# EAGLE design SUSTAINA-Core-Board (EAGLE 9.6.2)
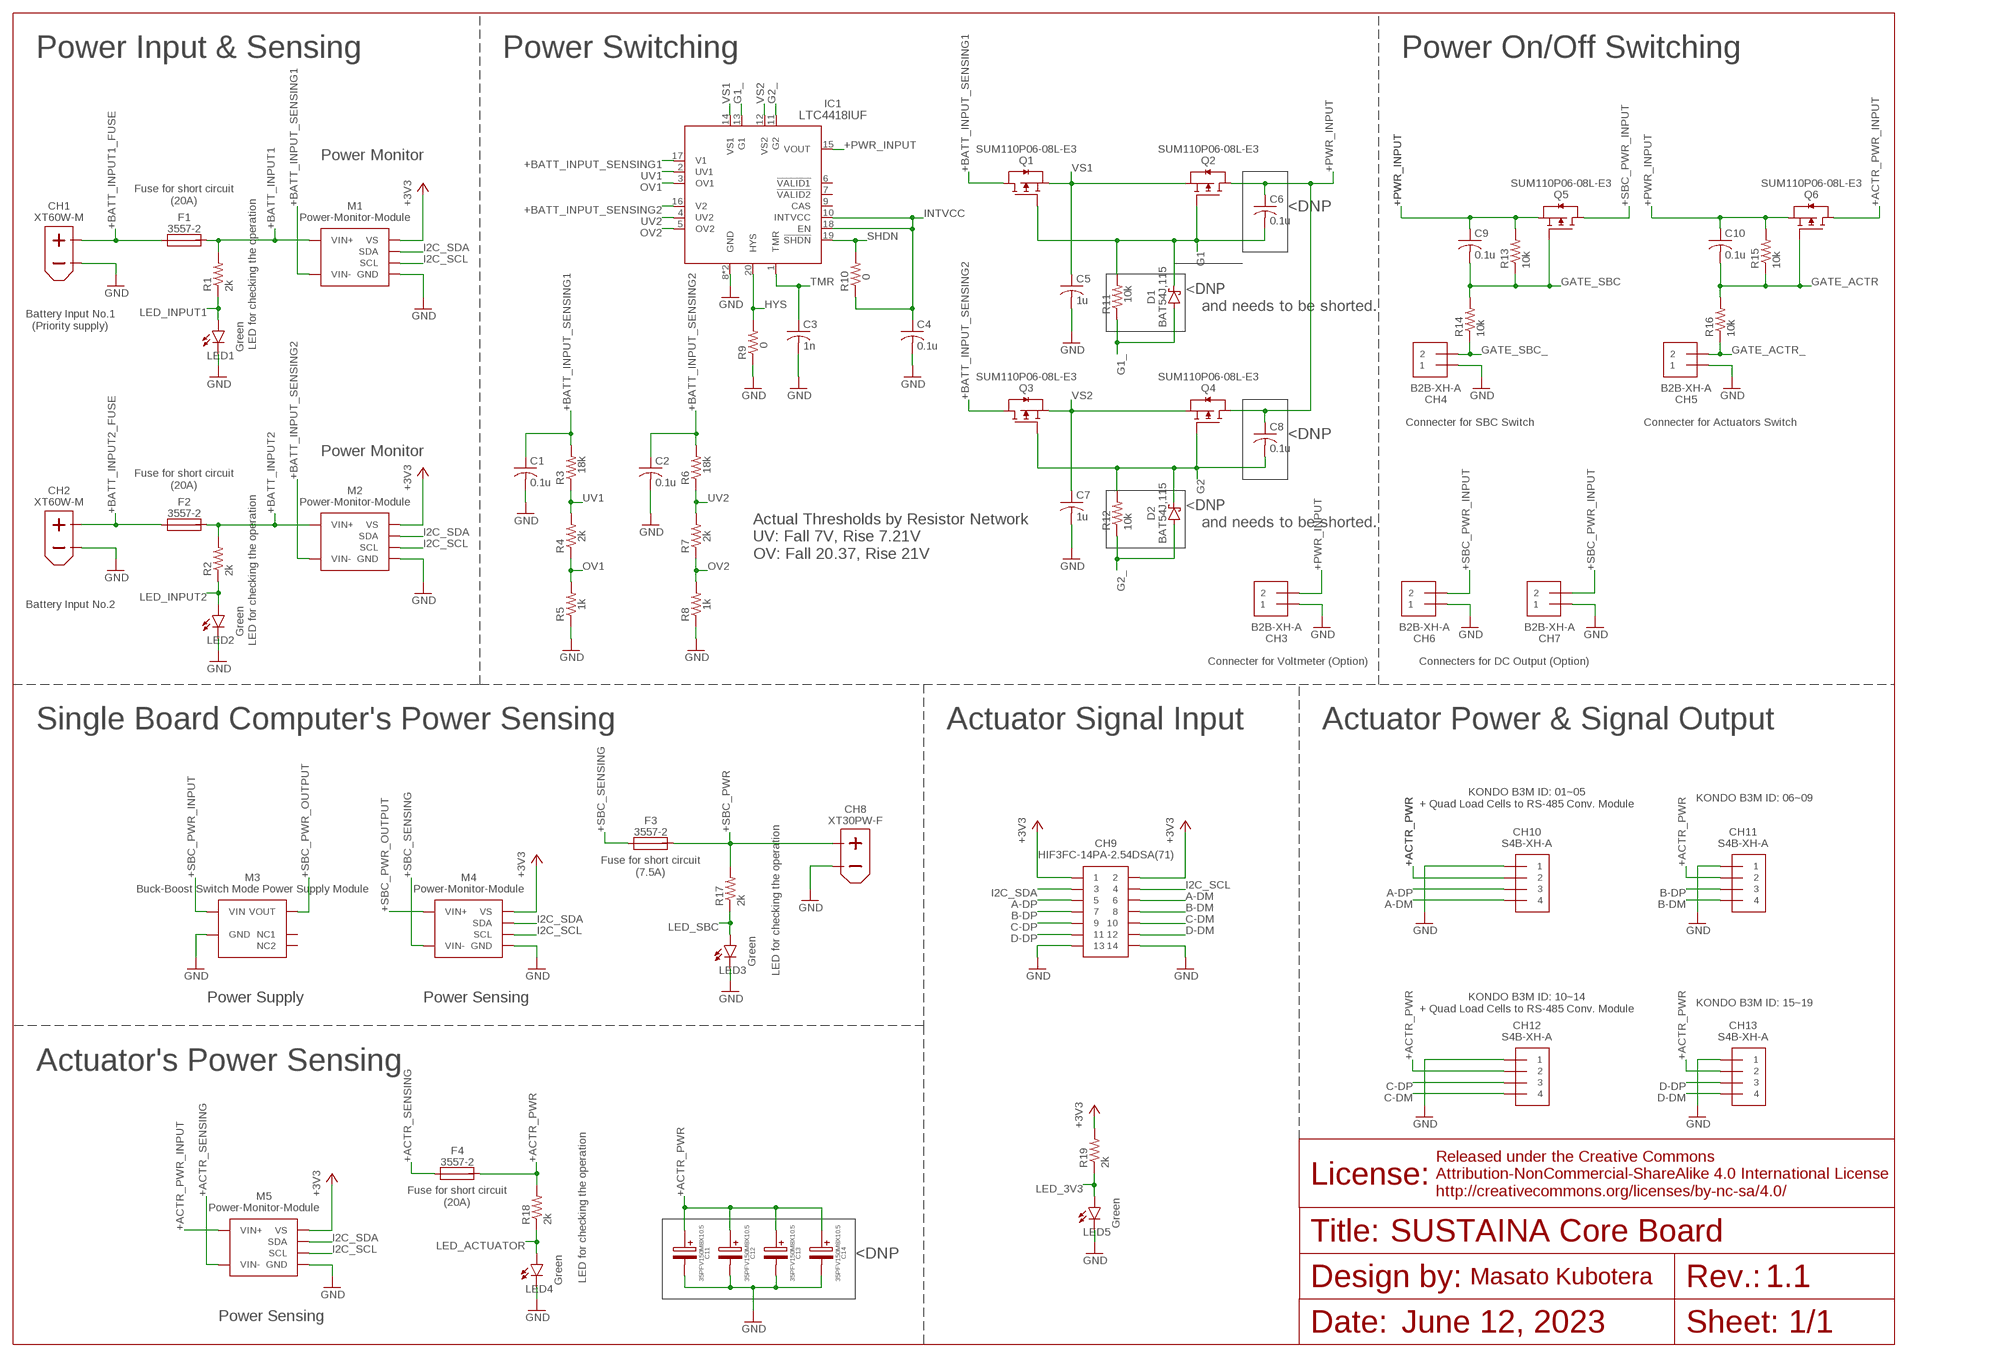
[diagram p0: schematic, sheet 1]

## Parts
C1  0.1u  C-USC0603  [C0603]
C2  0.1u  C-USC0603  [C0603]
C3  1n  C-USC0603  [C0603]
C4  0.1u  C-USC0603  [C0603]
C5  1u  C-USC0603  [C0603]
C6  0.1u  C-USC0603  [C0603]
C7  1u  C-USC0603  [C0603]
C8  0.1u  C-USC0603  [C0603]
C9  0.1u  C-USC0603  [C0603]
C10  0.1u  C-USC0603  [C0603]
C11  35PFV150M8X10.5  [35PFV150M8X10.5]
C12  35PFV150M8X10.5  [35PFV150M8X10.5]
C13  35PFV150M8X10.5  [35PFV150M8X10.5]
C14  35PFV150M8X10.5  [35PFV150M8X10.5]
CH1  XT60PW-M  [XT60PW-M]
CH2  XT60PW-M  [XT60PW-M]
CH3  B2B-XH-A  [B2B-XH-A]
CH4  B2B-XH-A  [B2B-XH-A]
CH5  B2B-XH-A  [B2B-XH-A]
CH6  B2B-XH-A  [B2B-XH-A]
CH7  B2B-XH-A  [B2B-XH-A]
CH8  XT30PW-F  [XT30PW-F]
CH9  HIF3FC-14PA-2.54DSA(71)  [HIF3FC-14PA-2.54DSA(71)]
CH10  S4B-XH-A  [S4B-XH-A]
CH11  S4B-XH-A  [S4B-XH-A]
CH12  S4B-XH-A  [S4B-XH-A]
CH13  S4B-XH-A  [S4B-XH-A]
D1  BAT54J,115  [SOD-323-2]
D2  BAT54J,115  [SOD-323-2]
F1  3557-2  [3557-2]
F2  3557-2  [3557-2]
F3  3557-2  [3557-2]
F4  3557-2  [3557-2]
IC1  LTC4418IUF  [LTC4418IUF]
LED1  Green  LEDSML0603  [SML0603]
LED2  Green  LEDSML0603  [SML0603]
LED3  Green  LEDSML0603  [SML0603]
LED4  Green  LEDSML0603  [SML0603]
LED5  Green  LEDSML0603  [SML0603]
M1  POWER-MONITOR-MODULE  [POWER-MONITOR-MODULE]
M2  POWER-MONITOR-MODULE  [POWER-MONITOR-MODULE]
M3  BUCK-BOOST-SWITCH-MODE-POWER-SUPPLY-MODULE  [BUCK-BOOST-SWITCH-MODE-POWER-SUPPLY-MODULE]
M4  POWER-MONITOR-MODULE  [POWER-MONITOR-MODULE]
M5  POWER-MONITOR-MODULE  [POWER-MONITOR-MODULE]
Q1  SUM110P06-08L-E3  [TO-252-3]
Q2  SUM110P06-08L-E3  [TO-252-3]
Q3  SUM110P06-08L-E3  [TO-252-3]
Q4  SUM110P06-08L-E3  [TO-252-3]
Q5  SUM110P06-08L-E3  [TO-252-3]
Q6  SUM110P06-08L-E3  [TO-252-3]
R1  2k  R-US_R0603  [R0603]
R2  2k  R-US_R0603  [R0603]
R3  18k  R-US_R0603  [R0603]
R4  2k  R-US_R0603  [R0603]
R5  1k  R-US_R0603  [R0603]
R6  18k  R-US_R0603  [R0603]
R7  2k  R-US_R0603  [R0603]
R8  1k  R-US_R0603  [R0603]
R9  0  R-US_R0603  [R0603]
R10  0  R-US_R0603  [R0603]
R11  10k  R-US_R0603  [R0603]
R12  10k  R-US_R0603  [R0603]
R13  10k  R-US_R0603  [R0603]
R14  10k  R-US_R0603  [R0603]
R15  10k  R-US_R0603  [R0603]
R16  10k  R-US_R0603  [R0603]
R17  2k  R-US_R0603  [R0603]
R18  2k  R-US_R0603  [R0603]
R19  2k  R-US_R0603  [R0603]

## Nets
+3V3 [low_power]: CH9.1 CH9.2 M1.VS M2.VS M4.VS M5.VS R19.2
+ACTR_PWR [power]: C11.+ C12.+ C13.+ C14.+ CH10.2 CH11.2 CH12.2 CH13.2 F4.3 F4.4 R18.2
+ACTR_PWR_INPUT [power]: M5.VIN+1(VIN+) M5.VIN+2(VIN+) M5.VIN+3(VIN+) M5.VIN+4(VIN+) M5.VIN+5(VIN+) M5.VIN+6(VIN+) M5.VIN+7(VIN+) M5.VIN+8(VIN+) M5.VIN+9(VIN+) M5.VIN+10(VIN+) Q6.4(D)
+ACTR_SENSING [middle_power]: F4.1 F4.2 M5.VIN-1(VIN-) M5.VIN-2(VIN-) M5.VIN-3(VIN-) M5.VIN-4(VIN-) M5.VIN-5(VIN-) M5.VIN-6(VIN-) M5.VIN-7(VIN-) M5.VIN-8(VIN-) M5.VIN-9(VIN-) M5.VIN-10(VIN-)
+BATT_INPUT1 [power]: F1.3 F1.4 M1.VIN+1(VIN+) M1.VIN+2(VIN+) M1.VIN+3(VIN+) M1.VIN+4(VIN+) M1.VIN+5(VIN+) M1.VIN+6(VIN+) M1.VIN+7(VIN+) M1.VIN+8(VIN+) M1.VIN+9(VIN+) M1.VIN+10(VIN+) R1.2
+BATT_INPUT1_FUSE [power]: CH1.+ F1.1 F1.2
+BATT_INPUT2 [power]: F2.3 F2.4 M2.VIN+1(VIN+) M2.VIN+2(VIN+) M2.VIN+3(VIN+) M2.VIN+4(VIN+) M2.VIN+5(VIN+) M2.VIN+6(VIN+) M2.VIN+7(VIN+) M2.VIN+8(VIN+) M2.VIN+9(VIN+) M2.VIN+10(VIN+) R2.2
+BATT_INPUT2_FUSE [power]: CH2.+ F2.1 F2.2
+BATT_INPUT_SENSING1 [power_signal]: C1.1 IC1.17(V1) M1.VIN-1(VIN-) M1.VIN-2(VIN-) M1.VIN-3(VIN-) M1.VIN-4(VIN-) M1.VIN-5(VIN-) M1.VIN-6(VIN-) M1.VIN-7(VIN-) M1.VIN-8(VIN-) M1.VIN-9(VIN-) M1.VIN-10(VIN-) Q1.4(D) R3.2
+BATT_INPUT_SENSING2 [power_signal]: C2.1 IC1.16(V2) M2.VIN-1(VIN-) M2.VIN-2(VIN-) M2.VIN-3(VIN-) M2.VIN-4(VIN-) M2.VIN-5(VIN-) M2.VIN-6(VIN-) M2.VIN-7(VIN-) M2.VIN-8(VIN-) M2.VIN-9(VIN-) M2.VIN-10(VIN-) Q3.4(D) R6.2
+PWR_INPUT [power]: C6.1 C8.1 C9.1 C10.1 CH3.2 IC1.15(VOUT) Q2.4(D) Q4.4(D) Q5.3(S) Q6.3(S) R13.2 R15.2
+SBC_PWR [middle_power]: CH8.+ F3.3 F3.4 R17.2
+SBC_PWR_INPUT [middle_power]: CH6.2 CH7.2 M3.VIN1(VIN) M3.VIN2(VIN) M3.VIN3(VIN) Q5.4(D)
+SBC_PWR_OUTPUT [middle_power]: M3.VOUT1(VOUT) M3.VOUT2(VOUT) M3.VOUT3(VOUT) M4.VIN+1(VIN+) M4.VIN+2(VIN+) M4.VIN+3(VIN+) M4.VIN+4(VIN+) M4.VIN+5(VIN+) M4.VIN+6(VIN+) M4.VIN+7(VIN+) M4.VIN+8(VIN+) M4.VIN+9(VIN+) M4.VIN+10(VIN+)
+SBC_SENSING [middle_power]: F3.1 F3.2 M4.VIN-1(VIN-) M4.VIN-2(VIN-) M4.VIN-3(VIN-) M4.VIN-4(VIN-) M4.VIN-5(VIN-) M4.VIN-6(VIN-) M4.VIN-7(VIN-) M4.VIN-8(VIN-) M4.VIN-9(VIN-) M4.VIN-10(VIN-)
A-DM [signal]: CH9.6 CH10.4
A-DP [signal]: CH9.5 CH10.3
B-DM [signal]: CH9.8 CH11.4
B-DP [signal]: CH9.7 CH11.3
C-DM [signal]: CH9.10 CH12.4
C-DP [signal]: CH9.9 CH12.3
D-DM [signal]: CH9.12 CH13.4
D-DP [signal]: CH9.11 CH13.3
G1 [power_signal]: C6.2 D1.1(C) Q1.1(G) Q2.1(G) R11.2
G1_ [power_signal]: D1.2(A) IC1.13(G1) R11.1
G2 [power_signal]: C8.2 D2.1(C) Q3.1(G) Q4.1(G) R12.2
G2_ [power_signal]: D2.2(A) IC1.11(G2) R12.1
GATE_ACTR [power_signal]: C10.2 Q6.1(G) R15.1 R16.2
GATE_ACTR_ [power_signal]: CH5.2 R16.1
GATE_SBC [power_signal]: C9.2 Q5.1(G) R13.1 R14.2
GATE_SBC_ [power_signal]: CH4.2 R14.1
GND: C1.2 C2.2 C3.2 C4.2 C5.2 C7.2 C11.- C12.- C13.- C14.- CH1.- CH2.- CH3.1 CH4.1 CH5.1 CH6.1 CH7.1 CH8.- CH9.13 CH9.14 CH10.1 CH11.1 CH12.1 CH13.1 IC1.8(GND) IC1.21(GND) LED1.C LED2.C LED3.C LED4.C LED5.C M1.GND M2.GND M3.GND1(GND) M3.GND2(GND) M3.GND3(GND) M3.GND4(GND) M3.GND5(GND) M3.GND6(GND) M4.GND M5.GND R5.1 R8.1 R9.1
HYS: IC1.20(HYS) R9.2
I2C_SCL [signal]: CH9.4 M1.SCL M2.SCL M4.SCL M5.SCL
I2C_SDA [signal]: CH9.3 M1.SDA M2.SDA M4.SDA M5.SDA
INTVCC: C4.1 IC1.10(INTVCC) IC1.18(EN) R10.1
LED_3V3 [low-power]: LED5.A R19.1
LED_ACTUATOR [low-power]: LED4.A R18.1
LED_INPUT1 [low-power]: LED1.A R1.1
LED_INPUT2 [low-power]: LED2.A R2.1
LED_SBC [low-power]: LED3.A R17.1
OV1 [power_signal]: IC1.3(OV1) R4.1 R5.2
OV2 [power_signal]: IC1.5(OV2) R7.1 R8.2
SHDN: IC1.19(!SHDN) R10.2
TMR: C3.1 IC1.1(TMR)
UV1 [power_signal]: IC1.2(UV1) R3.1 R4.2
UV2 [power_signal]: IC1.4(UV2) R6.1 R7.2
VS1 [power]: C5.1 IC1.14(VS1) Q1.3(S) Q2.3(S)
VS2 [power]: C7.1 IC1.12(VS2) Q3.3(S) Q4.3(S)
Unconnected: IC1.6(!VALID1) IC1.7(!VALID2) IC1.9(CAS) M3.NC1 M3.NC2

## Notes on the sheet
- Power Input & Sensing | Power Switching | Power On/Off Switching
- Power Monitor
- Fuse for short circuit
  (20A)
- <DNP
- LED for checking the operation
- <DNP
  　and needs to be shorted.
- Battery Input No.1
  (Priority supply)
- Connecter for SBC Switch | Connecter for Actuators Switch
- <DNP
- Power Monitor
- Fuse for short circuit
  (20A)
- Actual Thresholds by Resistor Network
  UV: Fall 7V, Rise 7.21V
  OV: Fall 20.37, Rise 21V
- <DNP
  　and needs to be shorted.
- LED for checking the operation
- Battery Input No.2
- Connecter for Voltmeter (Option) | Connecters for DC Output (Option)
- Single Board Computer's Power Sensing | Actuator Signal Input | Actuator Power & Signal Output
- KONDO B3M ID: 01~05
  + Quad Load Cells to RS-485 Conv. Module
- KONDO B3M ID: 06~09
- Fuse for short circuit
  (7.5A)
- LED for checking the operation
- Power Supply | Power Sensing
- KONDO B3M ID: 10~14
  + Quad Load Cells to RS-485 Conv. Module
- KONDO B3M ID: 15~19
- Actuator's Power Sensing
- Fuse for short circuit
  (20A)
- LED for checking the operation
- SUSTAINA Core Board
- <DNP
- 1.1
- Power Sensing
- June 12, 2023 | 1/1

## Library data of the parts
C1-C10 = rcl:C-US: CAPACITOR, American symbol; SPICEPREFIX: C
C11-C14 = 35PFV150M8X10.5:35PFV150M8X10.5
CH1 CH2 = AMASS_XT:XT60PW-M
CH3-CH7 = JST-XH:B2B-XH-A
CH8 = AMASS_XT:XT30PW-F
CH9 = HIF3FC:HIF3FC-14PA-2.54DSA(71)
CH10-CH13 = JST-XH:S4B-XH-A
D1 D2 = BAT54J,115:BAT54J,115
F1-F4 = 3557-2:3557-2
IC1 = LTC4418IUF:LTC4418IUF
LED1-LED5 = led:LED: LED OSRAM: - CHIPLED LG R971, LG N971, LY N971, LG Q971, LY Q971, LO R971, LY R971 LH N974, LH R974 LS Q976, LO Q976, LY Q976 LO Q996 - Hyper CHIPLED LW Q18S LB Q993, LB Q99A, LB R99A - SideLED LS A670, LO A670, LY A670, LG A670, LP A670 LB A673, LV A673, LT A673, LW A673 LH A674 LY A675 LS A676, LA A676, LO A676, LY A676, LW A676 LS A679, LY A679, LG A679 - Hyper Micro SIDELED® LS Y876, LA Y876, LO Y876, LY Y876 LT Y87S - SmartLED LW L88C, LW L88S LB L89C, LB L89S, LG L890 LS L89K, LO L89K, LY L89K LS L896, LA L896, LO L896, LY L896 - TOPLED LS T670, LO T670, LY T670, LG T670, LP T670 LSG T670, LSP T670, LSY T670, LOP T670, LYG T670 LG T671, LOG T671, LSG T671 LB T673, LV T673, LT T673, LW T673 LH T674 LS T676, LA T676, LO T676, LY T676, LB T676, LH T676, LSB T676, LW T676 LB T67C, LV T67C, LT T67C, LS T67K, LO T67K, LY T67K, LW E67C LS E67B, LA E67B, LO E67B, LY E67B, LB E67C, LV E67C, LT E67C LW T67C LS T679, LY T679, LG T679 LS T770, LO T770, LY T770, LG T770, LP T770 LB T773, LV T773, LT T773, LW T773 LH T774 LS E675, LA E675, LY E675, LS T675 LS T776, LA T776, LO T776, LY T776, LB T776 LHGB T686 LT T68C, LB T68C - Hyper Mini TOPLED® LB M676 - Mini TOPLED Santana® LG M470 LS M47K, LO M47K, LY M47K Source: http://www.osram.convergy.de LUXEON: - LUMILED® LXK2-PW12-R00, LXK2-PW12-S00, LXK2-PW14-U00, LXK2-PW14-V00 LXK2-PM12-R00, LXK2-PM12-S00, LXK2-PM14-U00 LXK2-PE12-Q00, LXK2-PE12-R00, LXK2-PE12-S00, LXK2-PE14-T00, LXK2-PE14-U00 LXK2-PB12-K00, LXK2-PB12-L00, LXK2-PB12-M00, LXK2-PB14-N00, LXK2-PB14-P00, LXK2-PB14-Q00 LXK2-PR12-L00, LXK2-PR12-M00, LXK2-PR14-Q00, LXK2-PR14-R00 LXK2-PD12-Q00, LXK2-PD12-R00, LXK2-PD12-S00 LXK2-PH12-R00, LXK2-PH12-S00 LXK2-PL12-P00, LXK2-PL12-Q00, LXK2-PL12-R00 Source: www.luxeon.com KINGBRIGHT: KA-3528ASYC Source: www.kingbright.com
M1 M2 M4 M5 = Power-Monitor-Module:POWER-MONITOR-MODULE
M3 = Buck-Boost-Switch-Mode-Power-Supply-Module:BUCK-BOOST-SWITCH-MODE-POWER-SUPPLY-MODULE
Q1-Q6 = SUM110P06-08L-E3:SUM110P06-08L-E3
R1-R19 = rcl:R-US_: RESISTOR, American symbol; SPICEPREFIX: R

## Net classes
0 default: clearance 0.127 mm
1 signal: width 0.203 mm, clearance 0.127 mm
2 power: width 0.254 mm, clearance 0.127 mm
4 power_signal: width 0.203 mm, clearance 0.127 mm
5 middle_power: width 0.508 mm, clearance 0.127 mm
6 low_power: width 0.203 mm, clearance 0.127 mm

## Board
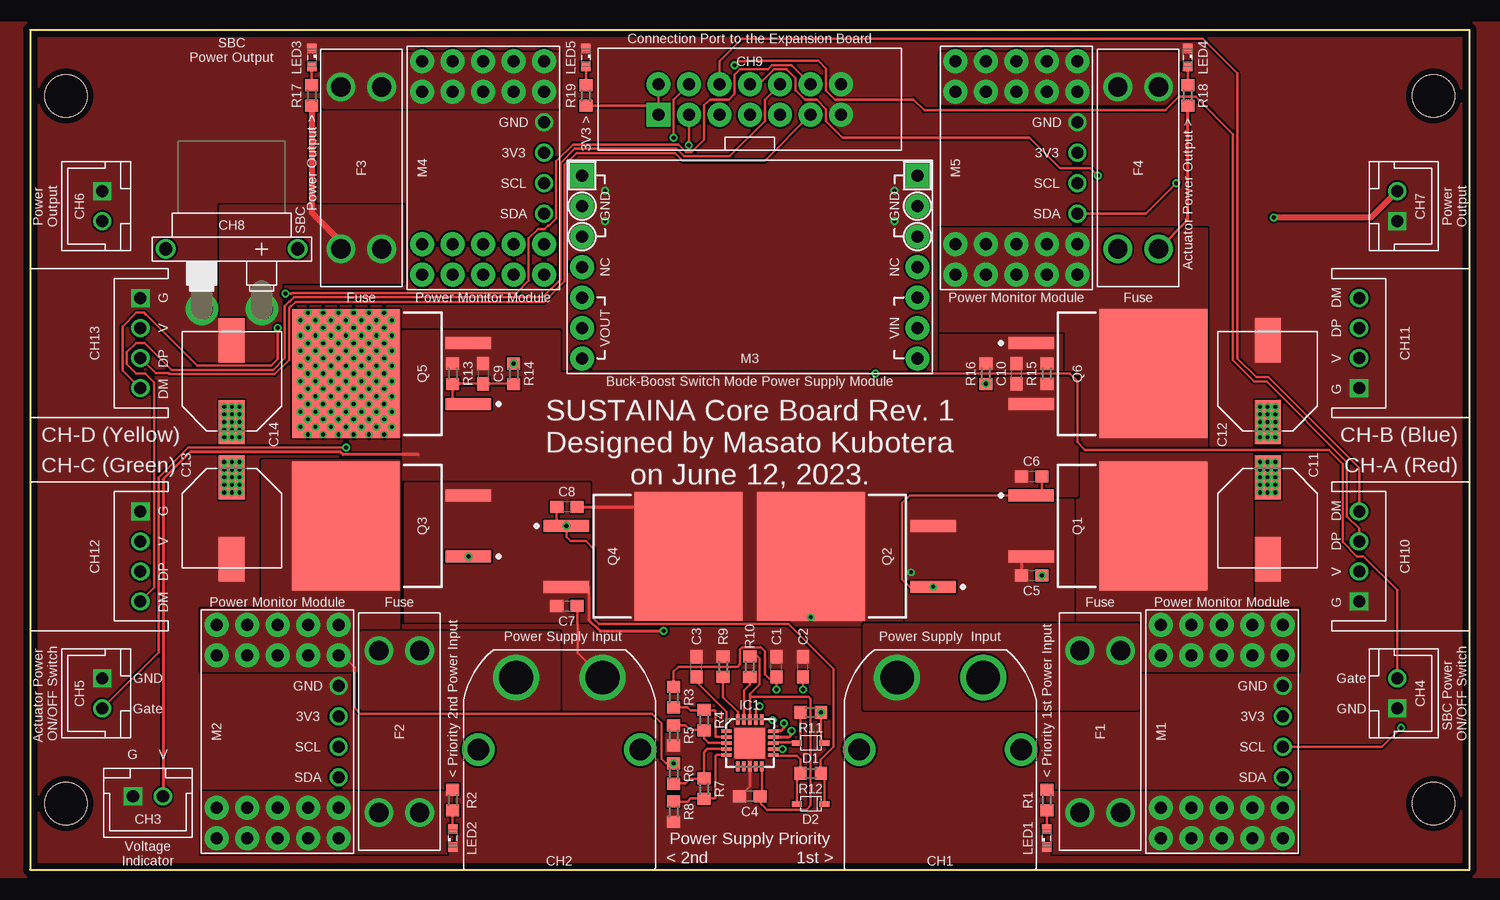
[diagram p1: board, top side]
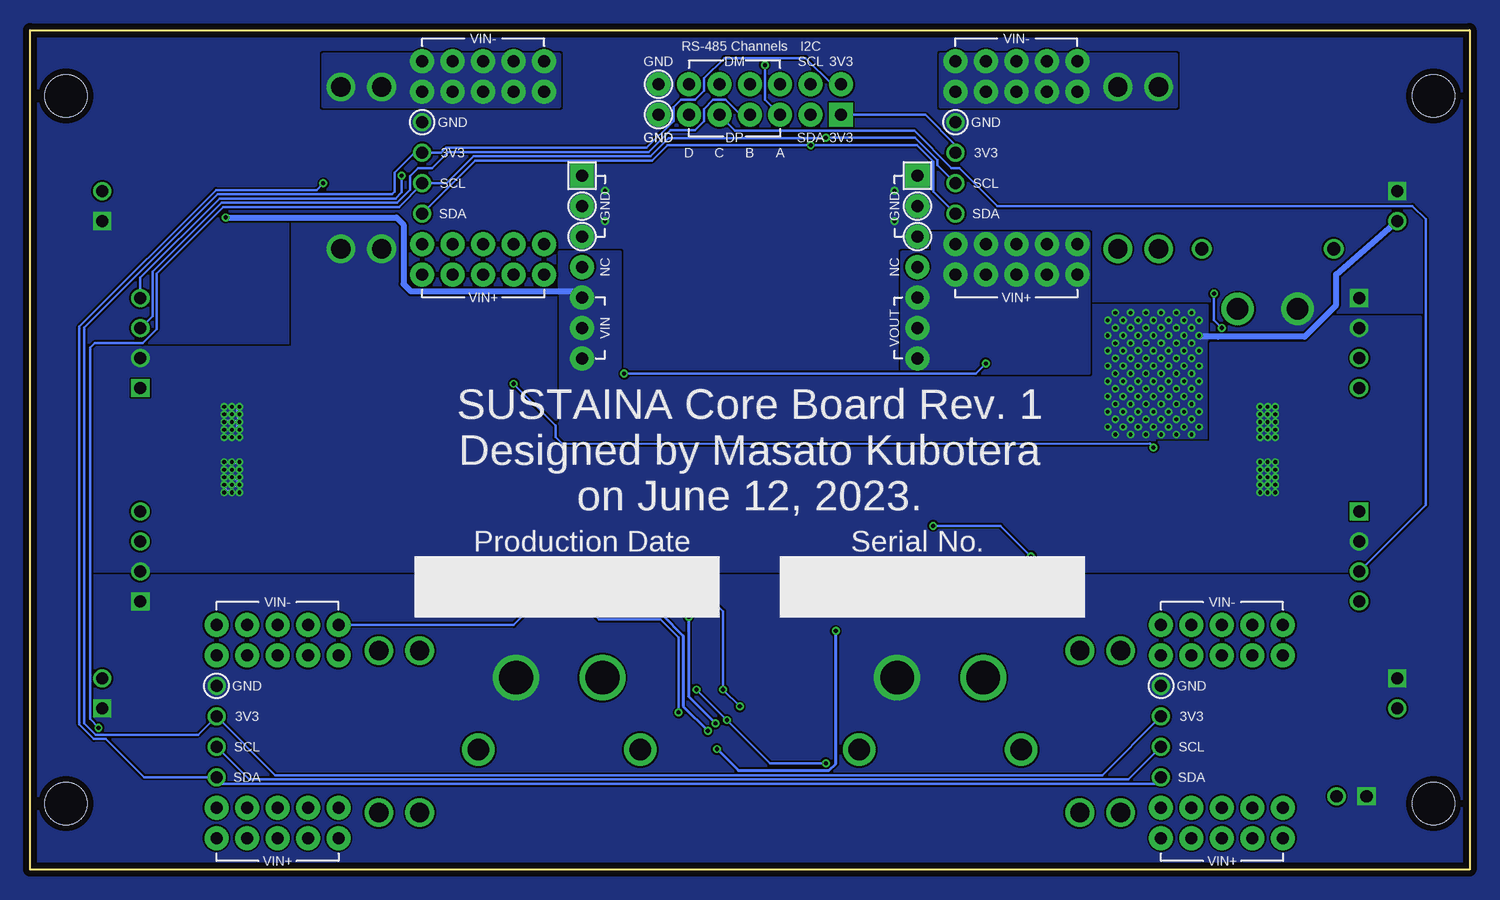
[diagram p2: board, bottom side, seen from below]

Size 120 x 70 mm. Coordinates in mm from the lower left corner, seen from the top.
Outline: 0,70 0,0 120,0 120,70 0,70
Copper layers (1*16): Top 0.035mm / dielectric 1.6mm / Bottom 0.035mm
Design rules "Elecrow_2-layer_PCB_eagle_rule": minimum track width 6mil, minimum drill 12mil, track to track 6mil, track to pad 6mil, pad to pad 6mil, via to via 8mil, smd to smd 0mil, copper to edge 20mil, drill to drill 10mil, minimum pad ring 6mil, minimum via ring 6mil, stop-mask expansion 0mil, vias tented up to drill 100mil, thermal gap 10mil
Holes 3.5 mm at 3,64.5 117,64.5 117,5.5 3,5.5

### Footprints (pad centres in the part's own frame; a part is rotated, then mirrored left to right if it is on the bottom)
C0603 = smd 1.1 x 1: 1 -0.85,0; 2 0.85,0
35PFV150M8X10.5 = smd 3.7 x 2.15: + -3.4,0; - 3.4,0
XT60PW-M = drill 1.8: 1 -6.75,-10; 2 6.75,-10 | drill 2.8: + 3.6,-16; - -3.6,-16
B2B-XH-A = drill 1.016 square: 1 -1.25,0 | drill 1.016: 2 1.25,0
XT30PW-F = drill 1.8: + 2.5,0; - -2.5,0 | drill 1.1: MH1 -5.5,5; MH2 5.5,5
HIF3FC-14PA-2.54DSA(71) = drill 1 pad 2 square: 1 7.62,1.29 | drill 1 pad 2: 2 7.62,-1.25; 3 5.08,1.29; 4 5.08,-1.25; 5 2.54,1.29; 6 2.54,-1.25; 7 0,1.29; 8 0,-1.25; 9 -2.54,1.29; 10 -2.54,-1.25; 11 -5.08,1.29; 12 -5.08,-1.25; 13 -7.62,1.29; 14 -7.62,-1.25
S4B-XH-A = drill 1.016 square: 1 3.75,0 | drill 1.016: 2 1.25,0; 3 -1.25,0; 4 -3.75,0
SOD-323-2 = smd 0.84 x 0.46: 1 -1.15,0; 2 1.15,0
3557-2 = drill 1.6: 1 -6.75,1.7; 2 -6.75,-1.7; 3 6.75,1.7; 4 6.75,-1.7
LTC4418IUF = smd 0.85 x 0.3: 1 -1.95,1; 2 -1.95,0.5; 3 -1.95,0; 4 -1.95,-0.5; 5 -1.95,-1; 11 1.95,-1; 12 1.95,-0.5; 13 1.95,0; 14 1.95,0.5; 15 1.95,1 | smd 0.3 x 0.85: 6 -1,-1.95; 7 -0.5,-1.95; 8 0,-1.95; 9 0.5,-1.95; 10 1,-1.95; 16 1,1.95; 17 0.5,1.95; 18 0,1.95; 19 -0.5,1.95; 20 -1,1.95 | smd 2.55 x 2.55: 21 0,0
SML0603 = smd 0.8 x 0.8: A 0.75,0; C -0.75,0
POWER-MONITOR-MODULE = drill 1: GND 13.97,-11.43; SCL 8.89,-11.43; SDA 6.35,-11.43; VS 11.43,-11.43 | drill 1 pad 2: VIN+1 1.27,-1.27; VIN+2 3.81,-1.27; VIN+3 1.27,-3.81; VIN+4 3.81,-3.81; VIN+5 1.27,-6.35; VIN+6 3.81,-6.35; VIN+7 1.27,-8.89; VIN+8 3.81,-8.89; VIN+9 1.27,-11.43; VIN+10 3.81,-11.43; VIN-1 16.51,-1.27; VIN-2 19.05,-1.27; VIN-3 16.51,-3.81; VIN-4 19.05,-3.81; VIN-5 16.51,-6.35; VIN-6 19.05,-6.35; VIN-7 16.51,-8.89; VIN-8 19.05,-8.89; VIN-9 16.51,-11.43; VIN-10 19.05,-11.43
BUCK-BOOST-SWITCH-MODE-POWER-SUPPLY-MODULE = drill 1 pad 2: GND1 1.27,-11.43; GND2 1.27,-13.97; GND4 29.21,-11.43; GND5 29.21,-13.97; NC1 1.27,-8.89; NC2 29.21,-8.89; VIN1 1.27,-1.27; VIN2 1.27,-3.81; VIN3 1.27,-6.35; VOUT1 29.21,-1.27; VOUT2 29.21,-3.81; VOUT3 29.21,-6.35 | drill 1 pad 2 square: GND3 1.27,-16.51; GND6 29.21,-16.51
TO-252-3 = smd 3.8 x 1: 1 -6.4,2.54; 3 -6.4,-2.54 | smd 9 x 10.75: 4 3.8,0
R0603 = smd 1 x 1.1: 1 -0.85,0; 2 0.85,0

### Placement (x,y rotation side)
C1  62.22,16.9 90 top
C2  64.44,16.9 90 top
C3  55.55,16.9 90 top
C4  60,6.11 180 top
C5  83.5,24.52 0 top
C6  83.5,32.78 0 top
C7  44.76,21.98 0 top
C8  44.76,30.24 180 top
C9  37.77,41.35 270 top
C10  82.22,41.35 90 top
C11  103.18,29.29 270 top
C12  103.18,40.72 90 top
C13  16.82,29.29 270 top
C14  16.82,40.72 90 top
CH1  75.88,0 180 top
CH2  44.12,0 180 top
CH3  9.84,6.11 0 top
CH4  113.97,14.68 90 top
CH5  6.02,14.68 270 top
CH6  6.02,55.32 270 top
CH7  113.97,55.32 90 top
CH8  16.82,46.75 0 top
CH9  60,64.21 180 top
CH10  110.8,26.11 270 top
CH11  110.8,43.89 270 top
CH12  9.2,26.11 90 top
CH13  9.2,43.89 90 top
D1  65.08,10.55 180 top
D2  65.08,5.47 180 top
F1  89.21,11.5 270 top
F2  30.79,11.5 270 top
F3  27.62,58.5 270 top
F4  92.38,58.5 270 top
IC1  60,10.55 0 top
LED1  84.77,2.62 90 top
LED2  35.23,2.62 90 top
LED3  23.49,67.7 270 top
LED4  96.51,67.7 270 top
LED5  46.35,67.7 270 top
M1  93.02,1.34 90 top
M2  14.28,1.34 90 top
M3  75.24,41.35 180 top
M4  31.43,48.34 90 top
M5  75.88,48.34 90 top
Q1  89.84,28.65 0 top
Q2  68.89,26.11 180 top
Q3  30.16,28.65 180 top
Q4  51.11,26.11 0 top
Q5  30.16,41.35 180 top
Q6  89.84,41.35 0 top
R1  84.77,5.79 90 top
R2  35.23,5.79 90 top
R3  53.65,14.36 90 top
R4  56.19,12.46 90 top
R5  53.65,11.19 90 top
R6  53.65,8.01 90 top
R7  56.19,6.74 90 top
R8  53.65,4.84 90 top
R9  57.78,16.9 270 top
R10  60,16.9 270 top
R11  65.08,13.09 0 top
R12  65.08,8.01 0 top
R13  35.23,41.35 90 top
R14  40.31,41.35 270 top
R15  84.77,41.35 270 top
R16  79.69,41.35 90 top
R17  23.49,64.53 270 top
R18  96.51,64.53 270 top
R19  46.35,64.53 270 top

### Tracks (layer width: path | path; a pad name or v marks a point on that pad's centre or on a via)
+3V3
  Top 0.203: CH9.2 52.38,63.36 | 52.38,63.36 52.06,63.68 R19.2 | 52.38,63.36 CH9.1
  Bottom 0.203: CH9.1 45.38,62.92 42.86,60.4 M4.VS | M2.VS 30.61,7.88 99.55,7.88 M1.VS 105.98,11.24 114.53,11.24 115.47,12.18 115.47,45.17 104.34,56.31 89.81,56.31 89.6,56.52 89.6,58.1 87.94,59.77 M5.VS 85.72,59.77 85.3,60.18 68.59,60.18 66.37,62.4 66.37,63.56 65.72,64.21 64.56,64.21 63.81,64.96 63.81,65.96 62.12,67.65 55.34,67.65 53.15,65.46 CH9.2
+ACTR_PWR  (via drill 0.3)
  Top 0.254: F4.3 96.51,54.17 R18.2 | C13.+ v16.82,32.71
  Top 0.508: C11.+ v103.18,32.08
  Bottom 0.254: v102.55,37.95 102.55,37.98 103.18,37.98 v103.18,37.95 103.24,37.98 103.81,37.98 v103.81,37.95 | v102.55,36.05 102.55,36.08 103.18,36.08 v103.18,36.05 | v103.18,36.68 v103.18,36.05 | v103.18,36.68 103.12,36.71 102.55,36.71 v102.55,36.68 102.67,36.78 102.67,37.16 102.55,37.29 v102.55,37.31 | v102.55,37.95 102.61,37.86 102.61,37.41 v102.55,37.31 | v102.55,37.95 102.67,38.05 102.67,38.43 102.55,38.56 v102.55,38.59 102.67,38.56 103.18,38.56 v103.18,38.59 103.24,38.56 103.81,38.56 v103.81,38.59 | v102.55,37.31 102.67,37.35 103.18,37.35 C12.+ 103.24,37.35 103.81,37.35 v103.81,37.31 | v103.81,36.05 103.81,36.08 103.24,36.08 v103.18,36.05 | v103.81,36.68 103.81,36.65 103.31,36.65 v103.18,36.68 | v102.55,31.44 102.55,31.57 102.61,31.63 102.61,31.95 102.55,32.02 v102.55,32.08 | v102.55,32.08 102.67,32.02 103.18,32.02 v103.18,32.08 v103.18,31.44 103.24,31.51 103.62,31.51 103.69,31.44 v103.81,31.44 103.69,31.57 103.69,31.89 103.81,32.02 v103.81,32.08 | v102.55,32.08 102.67,32.14 102.67,32.52 102.55,32.65 v102.55,32.71 102.74,32.59 102.93,32.59 103.05,32.71 v103.18,32.71 | v102.55,33.35 v103.18,33.35 | v103.18,33.98 v103.18,33.35 | v102.55,33.98 102.55,33.92 103.12,33.92 v103.18,33.98 | v103.18,33.35 v103.18,32.71 | v103.81,32.71 103.24,32.71 v103.18,32.71 | v103.81,33.35 103.24,33.35 v103.18,33.35 | v103.81,33.98 103.81,33.92 103.24,33.92 v103.18,33.98
  other vias: 16.19,36.05 16.19,36.68 16.19,37.31 16.19,37.95 16.19,38.59 16.82,36.05 16.82,36.68 16.82,37.31 16.82,37.95 16.82,38.59 17.45,36.05 17.45,36.68 17.45,37.31 17.45,37.95 17.45,38.59 16.19,31.44 16.19,32.08 16.19,32.71 16.19,33.35 16.19,33.98 16.82,31.44 16.82,32.08 16.82,33.35 16.82,33.98 17.45,31.44 17.45,32.08 17.45,32.71 17.45,33.35 17.45,33.98 103.18,37.31
  pour Bottom (rank 2, no thermals): 4.12,46.11 4.12,30.24 9.52,24.84 114.61,24.84 114.61,43.57 98.1,43.57 98.1,54.05 88.89,54.05 88.89,48.34 76.19,48.34 76.19,35.63 21.58,35.63 21.58,43.89 13.65,43.89 11.42,46.11
+ACTR_PWR_INPUT
  pour Top (rank 5, no thermals): 98.1,53.41 75.88,53.41 75.88,44.21 85.72,44.21 85.72,35 98.1,35
+ACTR_SENSING
  pour Top (no thermals): 75.88,68.02 75.88,63.89 95.56,63.89 95.56,68.02
  pour Bottom (no thermals): 75.88,68.02 75.88,63.58 95.56,63.58 95.56,68.02
+BATT_INPUT1
  pour Top (no thermals): 84.77,6.43 84.77,1.34 105.72,1.34 105.72,6.43
+BATT_INPUT1_FUSE
  pour Top (no thermals): 69.53,20.39 69.53,13.41 92.38,13.41 92.38,20.39
+BATT_INPUT2
  pour Top (no thermals): 14.28,6.43 14.28,1.34 35.23,1.34 35.23,6.43
+BATT_INPUT2_FUSE
  pour Top (no thermals): 27.62,19.76 27.62,13.41 44.12,13.41 44.12,19.76
+BATT_INPUT_SENSING1  (via drill 0.35)
  Top 0.203: C1.1 62.22,15.95 | 62.22,15.95 v62.22,15 | IC1.17 60.5,13.27 v60.83,13.6 | R3.2 53.65,16.51 54.04,16.9 58.97,16.9 59.2,17.13 59.2,18.36 59.34,18.51 60.94,18.51 61.27,18.17 61.27,16.27 61.59,15.95 62.22,15.95
  Bottom 0.203: v60.83,13.6 v62.22,15 62.22,21.54 66.02,25.33 74.75,25.33 79.69,20.39 M1.VIN-2
  pour Top (rank 4, no thermals): 87.31,34.68 87.31,16.59 105.72,16.59 105.72,21.66 101.91,21.66 101.91,34.68
+BATT_INPUT_SENSING2  (via drill 0.35)
  Top 0.203: v61.91,12.46 61.86,12.5 IC1.16 | C2.1 v64.44,15 | M2.VIN-9 26.03,17.86 27.04,16.84 27.04,13.47 27.53,12.99 51.85,12.99 52.65,12.19 52.65,9.23 53.02,8.86 R6.2
  Bottom 0.203: v64.44,15 v61.91,12.46 58.31,8.86 R6.2
  other vias: 53.65,8.86
  pour Top (rank 2, no thermals): 14.28,16.59 30.79,16.59 30.79,34.05 19.36,34.05 19.36,21.66 14.28,21.66
+PWR_INPUT  (via drill 0.3, 0.35)
  Top 0.254: Q2.4 v65.09,21.03 | v62.86,12.19 62.86,11.82 62.59,11.55 IC1.15 | CH3.2 11.09,32.55 13.36,34.81 25.87,34.81 26.09,34.59 32.38,34.59 | 55.55,25.79 55.55,26.11 54.44,27.22 53.33,26.11 54.6,24.84 55.24,25.48 50.48,30.24 C8.1
  Bottom 0.254: v65.09,21.03 65.09,14.42 v62.86,12.19
  pour Top (rank 3, no thermals): 31.11,44.84 31.11,32.46 46.98,32.46 46.98,20.39 72.7,20.39 72.7,31.19 87.31,31.19 87.31,41.35 44.12,41.35 44.12,44.84
+SBC_PWR
  Top 0.508: R17.2 23.49,54.79 25.91,52.36 F3.4
  pour Top (no thermals): 15.87,55.32 15.87,45.16 20.95,45.16 20.95,48.97 31.11,48.97 31.11,55.32
+SBC_PWR_INPUT  (via drill 0.3, 0.35)
  Top 0.508: CH7.2 111.77,54.37 v103.69,54.37 | Q5.4 26.34,41.36 v26.34,41.98
  Bottom 0.508: CH6.2 11.1,49.62 11.1,47.06 13.74,44.43 20.95,44.43 22.44,44.43 v22.53,44.52 | M3.VIN3 74.47,48.2 88.23,48.2 88.86,48.83 88.86,53.78 89.45,54.37 v103.69,54.37
  other vias: 29.52,40.08 29.52,36.27 29.52,37.54 29.52,38.81 29.52,41.35 29.52,42.62 29.52,43.89 29.52,45.16 29.52,46.43 28.25,40.08 28.25,36.27 28.25,37.54 28.25,38.81 28.25,41.35 28.25,42.62 28.25,43.89 28.25,45.16 28.25,46.43 26.98,40.08 26.98,36.27 26.98,37.54 26.98,38.81 26.98,41.35 26.98,42.62 26.98,43.89 26.98,45.16 26.98,46.43 25.71,40.08 25.71,36.27 25.71,37.54 25.71,38.81 25.71,41.35 25.71,42.62 25.71,43.89 25.71,45.16 25.71,46.43 24.44,40.08 24.44,36.27 24.44,37.54 24.44,38.81 24.44,41.35 24.44,42.62 24.44,43.89 24.44,45.16 24.44,46.43 23.17,40.08 23.17,36.27 23.17,37.54 23.17,38.81 23.17,41.35 23.17,42.62 23.17,43.89 23.17,45.16 23.17,46.43 22.53,39.45 22.53,36.91 22.53,38.17 22.53,40.72 22.53,41.98 22.53,43.26 22.53,45.8 23.8,39.45 23.8,36.91 23.8,38.17 23.8,40.72 23.8,41.98 23.8,43.26 23.8,44.52 23.8,45.8 25.08,39.45 25.08,36.91 25.08,38.17 25.08,40.72 25.08,41.98 25.08,43.26 25.08,44.52 25.08,45.8 26.34,39.45 26.34,36.91 26.34,38.17 26.34,40.72 26.34,43.26 26.34,44.52 26.34,45.8 27.62,39.45 27.62,36.91 27.62,38.17 27.62,40.72 27.62,41.98 27.62,43.26 27.62,44.52 27.62,45.8 28.89,39.45 28.89,36.91 28.89,38.17 28.89,40.72 28.89,41.98 28.89,43.26 28.89,44.52 28.89,45.8 30.16,39.45 30.16,36.91 30.16,38.17 30.16,40.72 30.16,41.98 30.16,43.26 30.16,44.52 30.16,45.8
  pour Bottom (rank 3, no thermals): 21.9,47.06 21.9,35.63 75.88,35.63 75.88,51.51 70.8,51.51 70.8,41.35 31.43,41.35 31.43,47.06
+SBC_PWR_OUTPUT
  pour Bottom (no thermals): 31.74,53.1 31.74,41.35 47.3,41.35 47.3,51.51 44.76,51.51 44.76,53.1
+SBC_SENSING
  pour Top (no thermals): 24.44,68.02 24.44,63.58 44.12,63.58 44.12,68.02
  pour Bottom (no thermals): 24.44,68.02 24.44,63.58 44.12,63.58 44.12,68.02
A-DM
  Top 0.203: CH9.6 57.46,67.38 59.34,69.26 97.78,69.26 100.64,66.4 100.64,42.62 102.22,41.05 103.24,41.05 110.8,33.48 CH10.4
A-DP  (via drill 0.35)
  Top 0.203: v58.73,67.07 59.05,67.38 59.65,67.38 59.69,67.42 65.72,67.42 66.37,66.77 66.37,64.94 67.1,64.21 73.66,64.21 74.55,63.31 94.66,63.31 95.78,64.43 97.17,64.43 100.28,61.31 100.28,42.47 102.07,40.69 103.09,40.69 109.78,33.99 109.78,29.44 110.8,28.42 CH10.3
  Bottom 0.203: CH9.5 58.73,64.19 v58.73,67.07
B-DM  (via drill 0.35)
  Top 0.203: v89.02,57.86 88.38,58.5 85.84,58.5 83.31,61.03 67.73,61.03 66.37,62.4 66.37,63.41 65.6,64.17 64.59,64.17 63.79,64.97 63.79,65.98 63.06,66.71 62.02,66.71 61.08,65.77 60.31,65.77 CH9.8
  Bottom 0.203: v89.02,57.86 89.02,56.46 89.53,55.95 104.19,55.95 110.8,49.34 CH11.4
B-DP
  Bottom 0.203: CH9.7 60.77,62.92 62.02,64.17 63.06,64.17 63.83,63.41 63.83,62.4 64.56,61.67 66.6,61.67 68.44,59.83 85.15,59.83 86.48,58.5 87.63,58.5 88.31,57.82 88.31,56.67 89.38,55.6 104.04,55.6 109.78,49.85 109.78,46.16 CH11.3
C-DM
  Top 0.203: CH12.4 10.36,23.52 10.36,40.6 9.61,41.35 8.87,41.35 8.08,42.14 8.08,43.14 8.83,43.89 9.57,43.89 11.8,41.66 20.26,41.66 21.24,42.64 21.24,46.98 21.6,47.34 21.64,47.34 22.02,47.71 42.74,47.71 44.22,49.19 44.22,58.91 45.4,60.09 53.9,60.09 54.53,59.46 58.32,59.46 61.26,62.41 61.26,64.18 CH9.10
C-DP
  Bottom 0.203: CH12.3 3.64,30.42 3.64,54.21 4.76,55.32 39.35,55.32 42.53,58.5 43.17,58.5 46.29,61.61 61.23,61.61 CH9.9
D-DM  (via drill 0.35)
  Top 0.203: CH13.4 7.73,41.61 7.73,45.28 8.87,46.43 9.52,46.43 9.66,46.28 9.67,46.28 13.95,42.01 20.12,42.01 20.65,42.55 v20.65,45.16 | v21.3,48.02 21.82,48.02 21.87,48.07 40.55,48.07 41.57,49.09 41.57,52.63 42.34,53.4 42.89,53.4 43.17,53.68 43.27,53.68 43.86,54.27 43.86,59.05 45.26,60.45 54.05,60.45 54.68,59.82 55.16,59.82 56.19,60.85 56.19,63.75 56.69,64.21 58.26,64.21 58.75,64.69 58.75,66.26 59.2,66.71 59.48,66.71 61.52,66.71 61.87,67.07 63.47,67.07 CH9.12
  Bottom 0.203: v21.3,48.02 21.3,45.81 v20.65,45.16
D-DP
  Top 0.203: CH13.3 10.46,41.38 11.58,41.38 11.65,41.3 20.41,41.3 21.6,42.49 21.6,46.83 21.75,46.98 21.79,46.98 22.14,47.33 42.86,47.33 44.57,49.04 44.57,58.76 45.55,59.74 53.75,59.74 54.38,59.11 61.27,59.11 CH9.11
G1  (via drill 0.3, 0.35)
  Top 0.203: C6.2 84.34,31.19 Q1.1 73.34,31.19 72.7,30.55 72.7,24.2 73.34,23.57 Q2.1 | D1.1 65.93,10.55 R11.2
  Bottom 0.203: R11.2 65.93,19.34 67.43,20.84 72.56,20.84 Q2.1
  other vias: 65.93,13.09 75.29,23.57
G1_
  Top 0.203: R11.1 64.23,10.55 D1.2 63.88,10.6 62,10.6 IC1.13
G2  (via drill 0.35)
  Top 0.203: D2.1 66.23,8.01 R12.2 65.91,8.08 65.91,9.16 66.96,10.21 66.96,16.74 63.22,20.48 47.45,20.48 46.98,20.95 46.98,26.74 46.35,27.38 45.08,27.38 44.71,27.75 Q4.1 44.32,28.65 | C8.2 43.91,29.06
  Top 0.254: 43.91,29.06 44.32,28.65
  Bottom 0.203: Q3.1 39.09,28.65 Q4.1
  other vias: 36.55,26.11 44.71,28.65
G2_
  Top 0.203: D2.2 63.93,7.71 R12.1 64.23,9.18 63.92,9.49 62.01,9.49 IC1.11
GATE_ACTR
  pour Top (rank 4, no thermals): 75.88,44.52 75.88,41.35 86.03,41.35 86.03,44.52
GATE_ACTR_  (via drill 0.35)
  Top 0.203: v26.34,35.2 13.2,35.2 10.71,32.7 10.71,18.12 CH5.2
  Bottom 0.203: R16.1 76.19,37.01 76.19,36.05 75.62,35.48 26.66,35.51 v26.34,35.2
  other vias: 79.69,40.5
GATE_SBC
  Top 0.203: Q5.1 35.23,38.81 R13.1 35.26,40.52 37.84,40.52 | 37.84,40.52 40.31,40.52 R14.2 | 37.84,40.52 C9.2
GATE_SBC_  (via drill 0.35)
  Top 0.203: v70.48,41.35 86.67,41.35 87.31,40.72 87.31,35.63 87.94,35 108.26,35 109.43,33.83 109.43,27.3 110.61,26.11 111.17,26.11 113.97,23.3 CH4.2
  Bottom 0.203: R14.1 41.16,41.35 v70.48,41.35
  other vias: 40.31,42.2
GND  (via drill 0.35)
  Top 0.203: C7.2 45.65,21.98 45.65,18.08 CH2.- | C4.2 60,6.96 IC1.8
  other vias: 84.34,24.52 47.94,56.59 47.94,54.05 72.06,56.59 72.06,54.05
  pour Top (rank 6, no thermals): -3.5,70.56 -3.5,-0.56 123.5,-0.56 123.5,70.56
  pour Bottom (rank 6, no thermals): -6.04,73.1 -6.04,-3.1 126.04,-3.1 126.04,73.1
HYS
  Top 0.203: IC1.20 59,13.14 57.78,14.36 R9.2
I2C_SCL  (via drill 0.35)
  Top 0.203: CH9.4 53.66,64.2 v53.66,61.03 | v114.29,11.82 112.7,10.23 M1.SCL
  Bottom 0.203: M2.SCL 28.43,7.52 101.73,7.52 M1.SCL | M4.SCL 44.34,58.71 44.34,59.16 46.21,61.03 v53.66,61.03 53.71,60.98 66.78,60.98 68.29,59.47 83.02,59.47 85.27,57.23 M5.SCL 87.31,57.17 89.23,55.24 103.89,55.24 109.43,49.71 109.43,45.08 110.61,43.89 114.61,43.89 114.99,43.51 114.99,12.56 114.29,11.86 v114.29,11.82
I2C_SDA  (via drill 0.35)
  Top 0.203: v95.56,57.23 93.02,54.69 M5.SDA | CH9.3 v54.92,60.4
  Bottom 0.203: M2.SDA 26.24,7.16 103.92,7.16 M1.SDA 110.48,7.7 113.67,10.89 114.68,10.89 115.88,12.09 115.88,45.27 104.48,56.66 96.12,56.66 v95.56,57.23 | M5.SDA 82.88,59.11 68.14,59.11 66.86,60.4 v54.92,60.4 46.08,60.4 44.7,59.01 44.7,56.52 M4.SDA
INTVCC
  Top 0.203: IC1.10 61,6.26 C4.1 60.95,6 60.95,5.47 61.44,4.99 64.72,4.99 65.08,5.35 65.08,14.23 64.9,14.42 60,14.42 | 60,14.42 IC1.18 | 60,14.42 60,14.64 60.8,15.45 60.8,17.61 60.66,17.75 R10.1
LED_3V3
  Top 0.203: LED5.A R19.1
LED_ACTUATOR
  Top 0.203: LED4.A R18.1
LED_INPUT1
  Top 0.203: R1.1 LED1.A
LED_INPUT2
  Top 0.203: LED2.A R2.1
LED_SBC
  Top 0.203: R17.1 LED3.A
OV1
  Top 0.203: IC1.3 56.57,10.55 56.19,10.93 R4.1 56.13,11.63 55.05,11.63 54.67,12.01 53.65,12.01 R5.2
OV2
  Top 0.203: IC1.5 57.22,9.55 57.14,9.48 57.14,5.98 57.08,5.92 56.19,5.92 R7.1 56.13,5.92 55.05,5.92 54.79,5.66 53.65,5.66 R8.2
SHDN
  Top 0.203: R10.2 60,15.42 59.5,14.92 IC1.19
TMR
  Top 0.203: C3.1 55.55,15.63 58.05,13.14 IC1.1
UV1
  Top 0.203: IC1.2 58.03,11.06 57.21,11.06 57.14,11.12 57.14,13.22 57.08,13.28 56.19,13.28 R4.2 56.13,13.28 55.05,13.28 54.79,13.54 53.65,13.54 R3.1
UV2
  Top 0.203: IC1.4 58.03,10.04 56.44,10.04 56.19,9.79 R7.2 56.13,7.57 55.05,7.57 54.67,7.19 53.65,7.19 R6.1
VS1  (via drill 0.3, 0.35)
  Top 0.254: Q1.3 82.64,26.11 C5.1 | v63.49,11.55 63.49,11.25 63.29,11.05 IC1.14
  Bottom 0.254: v73.46,24.78 69.91,21.22 67.27,21.22 65.55,19.5 65.55,13.61 v63.49,11.55
  pour Top (rank 5, no thermals): 72.7,31.19 72.7,20.39 90.16,20.39 90.16,31.19
VS2  (via drill 0.35)
  Top 0.254: v62.73,10.04 61.97,10.04 IC1.12 | Q4.3 46.6,23.57 46.6,20.79 47.5,19.89 v52.83,19.89
  Bottom 0.254: v62.73,10.04 60.94,8.26 53.4,8.26 52.83,8.83 v52.83,19.89
  pour Top (rank 2, no thermals): 31.27,32.14 31.27,20.71 46.66,20.71 46.66,32.14

### Text on the board
tPlace: Connection Port to the Expansion Board | SBC / Power Output | Power Output > | Actuator Power Output > | GND | GND | 3V3 > | 3V3 | 3V3 | SCL | SCL | SBC | Power / Output | SDA | GND | GND | SDA | Power / Output | NC | NC | G | Fuse | Power Monitor Module | Power Monitor Module | Fuse | DM | V | VOUT | VIN | DP | DP | V | Buck-Boost Switch Mode Power Supply Module | DM | G | CH-D (Yellow) | SUSTAINA Core Board Rev. 1 / Designed by Masato Kubotera / on June 12, 2023. | CH-B (Blue) | CH-C (Green) | CH-A (Red) | G | DM | V | DP | DP | V | DM | Power Monitor Module | Fuse | Fuse | Power Monitor Module | G | Power Supply Input | Power Supply Input | GND | Gate | Actuator Power / ON/OFF Switch | GND | GND | SBC Power / ON/OFF Switch | Gate | 3V3 | 3V3 | GND | G | V | SCL | SCL | SDA | < Priority 2nd Power Input | < Priority 1st Power Input | SDA | Power Supply Priority | Voltage / Indicator | < 2nd | 1st >
bPlace: VIN- | I2C | RS-485 Channels | VIN- | 3V3 | SCL | DM | GND | GND | GND | 3V3 | SDA | DP | GND | GND | 3V3 | A | B | C | D | 3V3 | SCL | SCL | SDA | GND | GND | SDA | NC | NC | VIN+ | VIN+ | VOUT | VIN | SUSTAINA Core Board Rev. 1 / Designed by Masato Kubotera / on June 12, 2023. | Serial No. | Production Date | VIN- | VIN- | GND | GND | 3V3 | 3V3 | SCL | SCL | SDA | SDA | VIN+ | VIN+